# Altium schematic sheet receiver.SchDoc
size A4; SheetNumber: 2; SheetTotal: 2
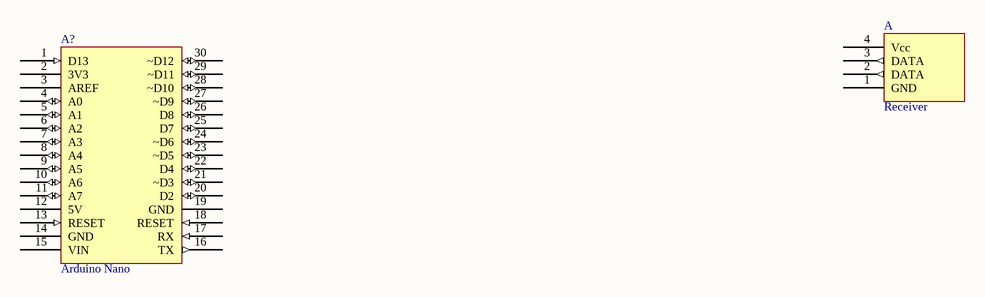
[diagram p0: receiver.SchDoc]

## Parts
A  Receiver
A?  Arduino Nano

## Nets

Not connected (* = marked no-connect by the designer): A 1(GND) 2(DATA) 3(DATA) 4(Vcc); A? 1(D13) 2(3V3) 3(AREF) 4(A0) 5(A1) 6(A2) 7(A3) 8(A4) 9(A5) 10(A6) 11(A7) 12(5V) 13(RESET) 14(GND) 15(VIN) 16(TX) 17(RX) 18(RESET) 19(GND) 20(D2) 21(~D3) 22(D4) 23(~D5) 24(~D6) 25(D7) 26(D8) 27(~D9) 28(~D10) 29(~D11) 30(~D12)

## Library data of the parts
A = Receiver: 433MHz RF Receiver Module
A? = Arduino Nano: Arduino Nano Microcontroller